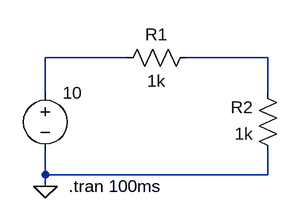
[diagram p0: schematic Simple Resistive Voltage Divider.asc]
Simple Resistive Voltage Divider.asc, the LTspice schematic file:
Version 4.1
SHEET 1 880 680
WIRE 144 112 32 112
WIRE 336 112 224 112
WIRE 32 160 32 112
WIRE 336 160 336 112
WIRE 32 272 32 240
WIRE 336 272 336 240
WIRE 336 272 32 272
WIRE 32 288 32 272
FLAG 32 288 0
SYMBOL res 240 96 R90
WINDOW 0 0 56 VBottom 2
WINDOW 3 32 56 VTop 2
SYMATTR InstName R1
SYMATTR Value 1k
SYMBOL res 352 256 R180
WINDOW 0 36 76 Left 2
WINDOW 3 36 40 Left 2
SYMATTR InstName R2
SYMATTR Value 1k
SYMBOL voltage 32 144 R0
WINDOW 123 0 0 Left 0
WINDOW 39 0 0 Left 0
SYMATTR InstName 10
SYMATTR Value ""
TEXT 64 288 Left 2 !.tran 100ms

The netlist it stands for:
* Simple Resistive Voltage Divider.asc
R1 N002 N001 1k
R2 0 N002 1k
V§10 N001 0
.tran 100ms
.backanno
.end